# Altium project picr22-team-GibiBot-mainboard.PrjPcb
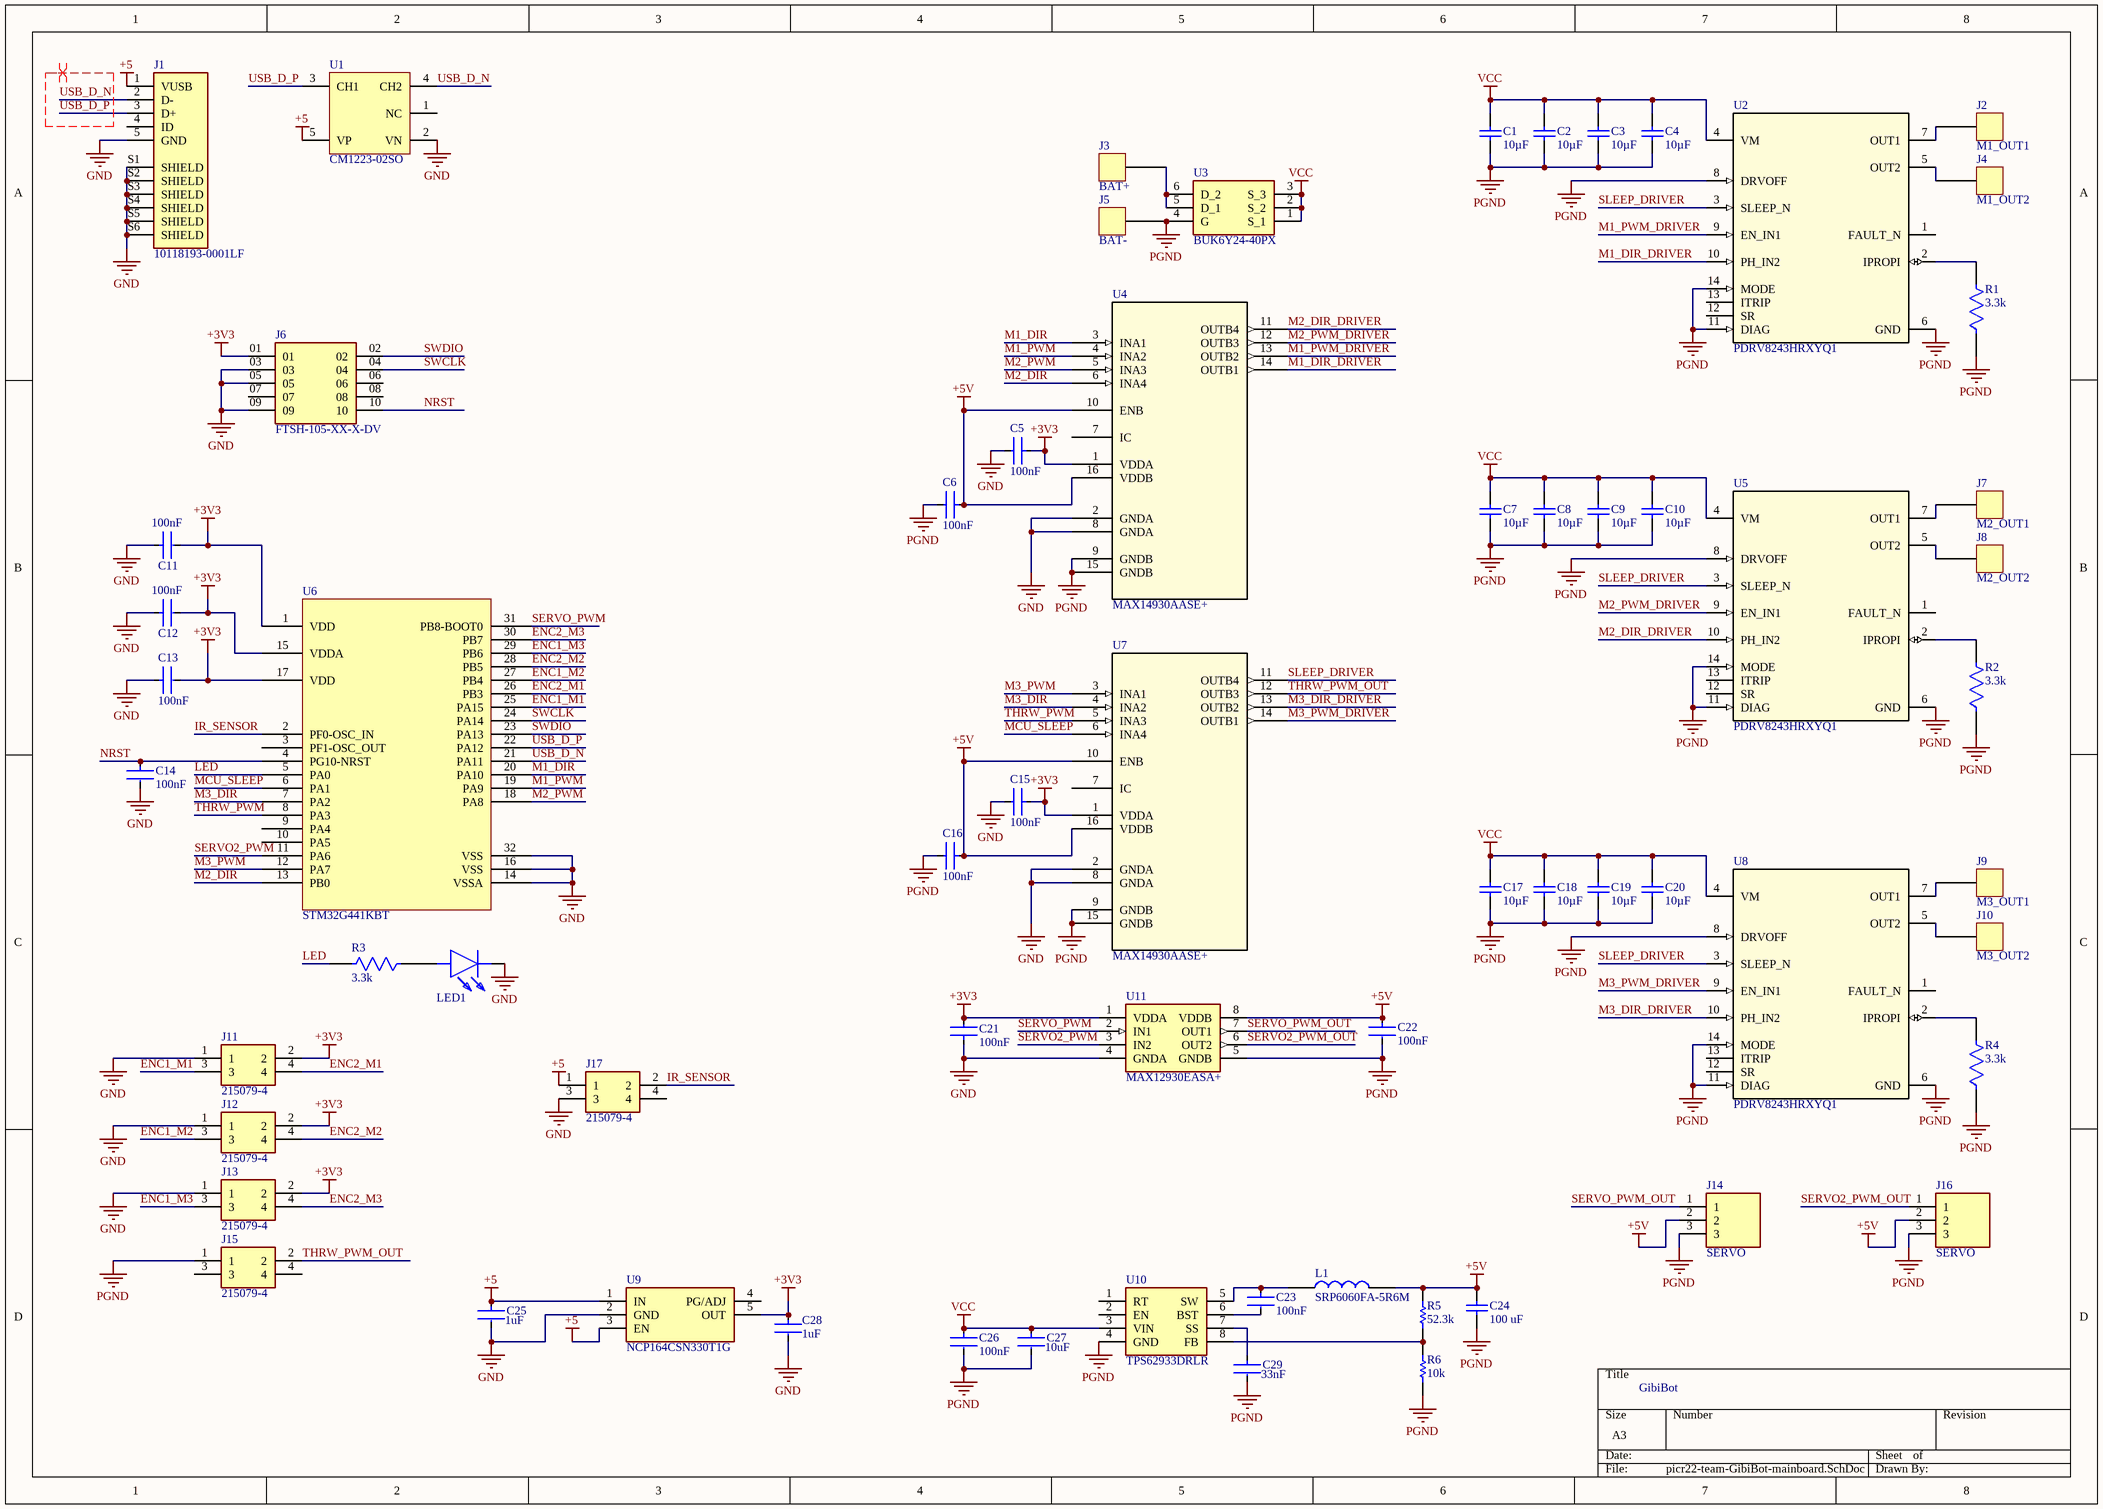
[diagram p0: picr22-team-GibiBot-mainboard.SchDoc]
1 sheet, 65 parts. Net scope: global (net labels, ports and power ports of the same name join across sheets).
Board file: picr22-team-GibiBot-mainboard.PcbDoc

## Sheet picr22-team-GibiBot-mainboard.SchDoc
size A3; SheetNumber: 1; SheetTotal: 1

### Parts
C1  Capacitance: 10µF  [MURA-0805_H_1.35_M]  (hidden comment: GRM21BR61A106KE19L)
C2  Capacitance: 10µF  [MURA-0805_H_1.35_M]  (hidden comment: GRM21BR61A106KE19L)
C3  Capacitance: 10µF  [MURA-0805_H_1.35_M]  (hidden comment: GRM21BR61A106KE19L)
C4  Capacitance: 10µF  [MURA-0805_H_1.35_M]  (hidden comment: GRM21BR61A106KE19L)
C5  Capacitance: 100nF  [FP-CGA3E-0_3-0_1-IPC_A]  (hidden comment: CGA3E2X7R1H104K080AA)
C6  Capacitance: 100nF  [FP-CGA3E-0_3-0_1-IPC_A]  (hidden comment: CGA3E2X7R1H104K080AA)
C7  Capacitance: 10µF  [MURA-0805_H_1.35_M]  (hidden comment: GRM21BR61A106KE19L)
C8  Capacitance: 10µF  [MURA-0805_H_1.35_M]  (hidden comment: GRM21BR61A106KE19L)
C9  Capacitance: 10µF  [MURA-0805_H_1.35_M]  (hidden comment: GRM21BR61A106KE19L)
C10  Capacitance: 10µF  [MURA-0805_H_1.35_M]  (hidden comment: GRM21BR61A106KE19L)
C11  Capacitance: 100nF  [FP-CGA3E-0_3-0_1-IPC_A]  (hidden comment: CGA3E2X7R1H104K080AA)
C12  Capacitance: 100nF  [FP-CGA3E-0_3-0_1-IPC_A]  (hidden comment: CGA3E2X7R1H104K080AA)
C13  Capacitance: 100nF  [FP-CGA3E-0_3-0_1-IPC_A]  (hidden comment: CGA3E2X7R1H104K080AA)
C14  Capacitance: 100nF  [FP-CGA3E-0_3-0_1-IPC_A]  (hidden comment: CGA3E2X7R1H104K080AA)
C15  Capacitance: 100nF  [FP-CGA3E-0_3-0_1-IPC_A]  (hidden comment: CGA3E2X7R1H104K080AA)
C16  Capacitance: 100nF  [FP-CGA3E-0_3-0_1-IPC_A]  (hidden comment: CGA3E2X7R1H104K080AA)
C17  Capacitance: 10µF  [MURA-0805_H_1.35_M]  (hidden comment: GRM21BR61A106KE19L)
C18  Capacitance: 10µF  [MURA-0805_H_1.35_M]  (hidden comment: GRM21BR61A106KE19L)
C19  Capacitance: 10µF  [MURA-0805_H_1.35_M]  (hidden comment: GRM21BR61A106KE19L)
C20  Capacitance: 10µF  [MURA-0805_H_1.35_M]  (hidden comment: GRM21BR61A106KE19L)
C21  Capacitance: 100nF  [FP-CGA3E-0_3-0_1-IPC_A]  (hidden comment: CGA3E2X7R1H104K080AA)
C22  Capacitance: 100nF  [FP-CGA3E-0_3-0_1-IPC_A]  (hidden comment: CGA3E2X7R1H104K080AA)
C23  Capacitance: 100nF  [FP-CGA3E-0_3-0_1-IPC_A]  (hidden comment: CGA3E2X7R1H104K080AA)
C24  Capacitance: 100 uF  [CAPC3216X190X55ML30T25]  (hidden comment: GRM31CR60J107ME39L)
C25  Capacitance: 1uF  [FP-C1608-080-0_1-MFG]  (hidden comment: C1608X5R1C105K080AA)
C26  Capacitance: 100nF  [FP-CGA3E-0_3-0_1-IPC_A]  (hidden comment: CGA3E2X7R1H104K080AA)
C27  Capacitance: 10uF  [FP-C3216-160-0_2-IPC_C]  (hidden comment: C3216X7R1V106M160AC)
C28  Capacitance: 1uF  [FP-C1608-080-0_1-MFG]  (hidden comment: C1608X5R1C105K080AA)
C29  Capacitance: 33nF  [FP-CL10-IPC_B]  (hidden comment: CL10B333KB8NNNC)
J1  10118193-0001LF  [FCI_10118193-0001LF]
J2  M1_OUT1  [Power pad]
J3  BAT+  [Power pad]
J4  M1_OUT2  [Power pad]
J5  BAT-  [Power pad]
J6  FTSH-105-XX-X-DV  [SAMTEC_FTSH-105-XX-X-DV]
J7  M2_OUT1  [Power pad]
J8  M2_OUT2  [Power pad]
J9  M3_OUT1  [Power pad]
J10  M3_OUT2  [Power pad]
J11  215079-4  [TE_215079-4]
J12  215079-4  [TE_215079-4]
J13  215079-4  [TE_215079-4]
J14  SERVO  [SERVO]
J15  215079-4  [TE_215079-4]
J16  SERVO  [SERVO]
J17  215079-4  [TE_215079-4]
L1  SRP6060FA-5R6M  [SRP6060FA5R6M]
LED1  150060SS75000  [LEDC1608X80N]  (value not drawn)
R1  Resistance: 3.3k  [FP-CRCW0603-e3-MFG]  (hidden comment: CRCW06031M00FKEA)
R2  Resistance: 3.3k  [FP-CRCW0603-e3-MFG]  (hidden comment: CRCW06031M00FKEA)
R3  Resistance: 3.3k  [FP-CRCW0603-e3-MFG]  (hidden comment: CRCW06031M00FKEA)
R4  Resistance: 3.3k  [FP-CRCW0603-e3-MFG]  (hidden comment: CRCW06031M00FKEA)
R5  Resistance: 52.3k  [RESC1608X55X25LL10T15]  (hidden comment: RC0603FR-0752K3L)
R6  Resistance: 10k  [RESC1609X50X30NL8T20]  (hidden comment: CRCW060310K0FKEA)
U1  CM1223-02SO  [ONSC-SOT23-5-527AH-01_L]
U2  PDRV8243HRXYQ1  [RXY0014A-MFG]
U3  BUK6Y24-40PX  [BUK6Y2440PX]
U4  MAX14930AASE+  [21-0041_S16+1_MXM]
U5  PDRV8243HRXYQ1  [RXY0014A-MFG]
U6  STM32G441KBT  [STM32G441KB]
U7  MAX14930AASE+  [21-0041_S16+1_MXM]
U8  PDRV8243HRXYQ1  [RXY0014A-MFG]
U9  NCP164CSN330T1G  [SOT95P275X110-5N]
U10  TPS62933DRLR  [SOTFL50P160X60-8N]
U11  MAX12930EASA+  [SOIC127P600X175-8N]

### Nets
+3V3: C5.1 C11.2 C12.2 C13.2 C15.1 C21.2 C28.2 J6.01 J11.2 J12.2 J13.2 U4.1(VDDA) U6.1(VDD) U6.15(VDDA) U6.17(VDD) U7.1(VDDA) U9.5(OUT) U11.1(VDDA)
+5: C25.2 J1.1(VUSB) J17.1 U1.5(VP) U9.1(IN) U9.3(EN)
+5V: C6.1 C16.1 C22.1 C24.2 J14.2 J16.2 L1.2 R5.2 U4.10(ENB) U4.16(VDDB) U7.10(ENB) U7.16(VDDB) U11.8(VDDB)
GND: C5.2 C11.1 C12.1 C13.1 C14.2 C15.2 C21.1 C25.1 C28.1 J1.5(GND) J1.S1(SHIELD) J1.S2(SHIELD) J1.S3(SHIELD) J1.S4(SHIELD) J1.S5(SHIELD) J1.S6(SHIELD) J6.03 J6.05 J6.09 J11.1 J12.1 J13.1 J17.3 LED1.1(K) U1.2(VN) U4.2(GNDA) U4.8(GNDA) U6.14(VSSA) U6.16(VSS) U6.32(VSS) U7.2(GNDA) U7.8(GNDA) U9.2(GND) U11.4(GNDA)
PGND: C1.1 C2.1 C3.1 C4.1 C6.2 C7.1 C8.1 C9.1 C10.1 C16.2 C17.1 C18.1 C19.1 C20.1 C22.2 C24.1 C26.2 C27.2 C29.2 J5.2(PAD) J14.3 J15.1 J16.3 R1.1 R2.1 R4.1 R6.1 U2.6(GND) U2.8(DRVOFF) U2.11(DIAG) U2.14(MODE) U3.4(G) U4.9(GNDB) U4.15(GNDB) U5.6(GND) U5.8(DRVOFF) U5.11(DIAG) U5.14(MODE) U7.9(GNDB) U7.15(GNDB) U8.6(GND) U8.8(DRVOFF) U8.11(DIAG) U8.14(MODE) U10.4(GND) U11.5(GNDB)
VCC: C1.2 C2.2 C3.2 C4.2 C7.2 C8.2 C9.2 C10.2 C17.2 C18.2 C19.2 C20.2 C26.1 C27.1 U2.4(VM) U3.1(S_1) U3.2(S_2) U3.3(S_3) U5.4(VM) U8.4(VM) U10.3(VIN)
ENC1_M1: J11.3 U6.25(PA15)
ENC1_M2: J12.3 U6.27(PB4)
ENC1_M3: J13.3 U6.29(PB6)
ENC2_M1: J11.4 U6.26(PB3)
ENC2_M2: J12.4 U6.28(PB5)
ENC2_M3: J13.4 U6.30(PB7)
IR_SENSOR: J17.2 U6.2(PF0-OSC_IN)
LED: R3.2 U6.5(PA0)
M1_DIR: U4.3(INA1) U6.20(PA10)
M1_DIR_DRIVER: U2.10(PH_IN2) U4.14(OUTB1)
M1_PWM: U4.4(INA2) U6.19(PA9)
M1_PWM_DRIVER: U2.9(EN_IN1) U4.13(OUTB2)
M2_DIR: U4.6(INA4) U6.13(PB0)
M2_DIR_DRIVER: U4.11(OUTB4) U5.10(PH_IN2)
M2_PWM: U4.5(INA3) U6.18(PA8)
M2_PWM_DRIVER: U4.12(OUTB3) U5.9(EN_IN1)
M3_DIR: U6.7(PA2) U7.4(INA2)
M3_DIR_DRIVER: U7.13(OUTB2) U8.10(PH_IN2)
M3_PWM: U6.12(PA7) U7.3(INA1)
M3_PWM_DRIVER: U7.14(OUTB1) U8.9(EN_IN1)
MCU_SLEEP: U6.6(PA1) U7.6(INA4)
NRST: C14.1 J6.10 U6.4(PG10-NRST)
SERVO2_PWM: U6.11(PA6) U11.3(IN2)
SERVO2_PWM_OUT: J16.1 U11.6(OUT2)
SERVO_PWM: U6.31(PB8-BOOT0) U11.2(IN1)
SERVO_PWM_OUT: J14.1 U11.7(OUT1)
SLEEP_DRIVER: U2.3(SLEEP_N) U5.3(SLEEP_N) U7.11(OUTB4) U8.3(SLEEP_N)
SWCLK: J6.04 U6.24(PA14)
SWDIO: J6.02 U6.23(PA13)
THRW_PWM: U6.8(PA3) U7.5(INA3)
THRW_PWM_OUT: J15.2 U7.12(OUTB3)
USB_D_N: J1.2(D-) U1.4(CH2) U6.21(PA11)
USB_D_P: J1.3(D+) U1.3(CH1) U6.22(PA12)
NetC23_1: C23.1 L1.1 U10.5(SW)
NetC23_2: C23.2 U10.6(BST)
NetC29_1: C29.1 U10.7(SS)
NetJ2_2: J2.2(PAD) U2.7(OUT1)
NetJ3_2: J3.2(PAD) U3.5(D_1) U3.6(D_2)
NetJ4_2: J4.2(PAD) U2.5(OUT2)
NetJ7_2: J7.2(PAD) U5.7(OUT1)
NetJ8_2: J8.2(PAD) U5.5(OUT2)
NetJ9_2: J9.2(PAD) U8.7(OUT1)
NetJ10_2: J10.2(PAD) U8.5(OUT2)
NetLED1_2: LED1.2(A) R3.1
NetR1_2: R1.2 U2.2(IPROPI)
NetR2_2: R2.2 U5.2(IPROPI)
NetR4_2: R4.2 U8.2(IPROPI)
NetR5_1: R5.1 R6.2 U10.8(FB)

Not connected (* = marked no-connect by the designer): J1 4(ID); J6 06 07 08; J15 3 4; J17 4; U1 1(NC); U2 1(FAULT_N) 12(SR) 13(ITRIP); U4 7(IC); U5 1(FAULT_N) 12(SR) 13(ITRIP); U6 3(PF1-OSC_OUT) 9(PA4) 10(PA5); U7 7(IC); U8 1(FAULT_N) 12(SR) 13(ITRIP); U9 4(PG/ADJ); U10 1(RT) 2(EN)

### Layout directives
differential pair; differential pair class USB: USB_D_N, USB_D_P

### Notes on the sheet
- GibiBot

### Library data of the parts
C1-C4 C7-C10 C17-C20 = CMP-2000-05254-1: CAP, Ceramic, 10 uF, 10%, 10 V, 0805, RoHS, Tape and Reel; Manufacturer: Murata; Voltage - Rated: 10V; Product Training Modules: High-CapMultilayerCeramicCapacitors; Catalog Drawings: GRMSeries_0805_1.25; Temperature Coefficient: X5R; Online Catalog: GRMSeries; Featured Product: GA3SafetyRecognizedCapsandHi-CapMLCC; Other Names: 490-1709-6; Applications: GeneralPurpose; Category: Capacitors; Datasheet Version: Aug-14; Datasheet URL: https://datasheet.ciiva.com/3777/210grm21br61a106ke1923-3777175.pdf; Ratings: -; Height - Seated (Max): -; Lead Spacing: -; Operating Temperature: -55degC~85degC; Features: -; Package Description: 2-Pin Surface Mount Device (0805), Body 2.1 x 1.35 mm; Standard Package: 1; Mounting Type: SurfaceMount,MLCC; Package Reference: 805; Tolerance: ±10%; Manufacturer URL: http://www.murata.com/; Size / Dimension: 0.079"Lx0.049"W(2.00mmx1.25mm); Packaging: Digi-Reel; Thickness (Max): 0.053"(1.35mm); Package / Case: 0805(2012Metric); Family: CeramicCapacitors; Series: GRM; Lead Style: -
C5 C6 C11-C16 C21-C23 C26 = CMP-2000-07546-2: Cap Ceramic 100nF 50V X7R 10% Pad SMD 0603 +125°C Automotive T/R; Weight: 7.1E-05oz; Composition: Ceramic; Max Operating Temperature: 125°C; Termination: SMD/SMT; Dielectric: X7R; Length: 1.6mm; Package Quantity: 1; REACH SVHC: No SVHC; Lead Free: Lead Free; Case Code (Metric): 1608; Min Operating Temperature: -55°C; Packaging: Tape and Reel; Tolerance: 10%; Voltage Rating: 50V; Case Code (Imperial): 0603; Case/Package: 0603; Voltage Rating (DC): 50V; Depth: 0.8mm; Radiation Hardening: No; Ratings: AEC-Q200; Mount: Surface Mount; Voltage: 50V; Thickness: 0.035inch; Width: 0.8mm; Height: 0.8mm
C24 = CMP-1662-00011-2: Chip Capacitor, 100 uF, +/- 20%, 6.3 V, -55 to 85 degC, 1206 (3216 Metric), RoHS, Tape and Reel; Case\/Package: 1206; Voltage Rating (DC): 6.3 V; Type (Capacitors): X5R; REACH SVHC: No SVHC; Height: 1.6 mm; Tolerance: 20%; Packaging: Tape and Reel; Mount: Surface Mount; PackageDescription: 2-Pin Surface Mount Device, Body 3.2 x 1.6 mm; ComponentLink1URL: http://www.murata.com/; Pins: 2; ComponentLink2Description: Datasheet; PackageReference: 1206; Width: 1.6 mm; Package Quantity: 2000; Min Operating Temperature: -55 degC; Case Code (Imperial): 1206; Max Operating Temperature: 85 degC; DatasheetVersion: 09/2016; Mounting Technology: Surface Mount; Voltage Rating: 6.3 V; ComponentLink1Description: Manufacturer URL; Radiation Hardening: No; Case Code (Metric): 3216; PartNumber: GRM31CR60J107ME39L; Length: 3.2 mm; ComponentLink2URL: http://psearch.en.murata.com/capacitor/product/GRM31CR60J107ME39%23.pdf; RoHSCompliant: true
C25 C28 = CMP-08246-006723-1: Multilayer Ceramic Capacitors 1μF ±10% 16V X5R SMD 0603; Package Quantity: 1; Contact Plating: Tin; Min Operating Temperature: -55°C; Voltage Rating (DC): 16V; RoHS Compliant: Yes; Construction: Flat; Height: 0.8mm; Resistor Type: Ceramic; Depth: 0.8mm; Case/Package: 0603; Mount: Surface Mount; Packaging: Tape and Reel; Dielectric: X5R; Number of Pins: 2; Radiation Hardening: No; Case Code (Metric): 1608; Dielectric Material: Ceramic; Voltage Rating: 16V; REACH SVHC: No SVHC; Series: C; Case Code (Imperial): 0603; Voltage: 16V; Width: 0.031inch; Tolerance: 10%; Max Operating Temperature: 85°C; Weight: 7.1E-05oz; Thickness: 0.037inch; Termination: SMD/SMT; Length: 1.6mm; Lead Free: Lead Free
C27 = CMP-2000-06048-2: Multilayer Ceramic Capacitors 10uF ±20% 35V X7R SMD 1206; RoHS Compliant: Yes; Voltage Rating (DC): 35V; Termination: SMD/SMT; Thickness: 0.071inch; Max Operating Temperature: 125°C; Length: 3.2mm; Width: 0.063inch; Tolerance: 20%; Case Code (Metric): 3216; REACH SVHC: No SVHC; Case/Package: 1206; Dielectric: X7R; Series: C; Min Operating Temperature: -55°C; Resistor Type: Ceramic; Weight: 0.000571oz; Voltage Rating: 35V; Mount: Surface Mount; Package Quantity: 2000; Case Code (Imperial): 1206; Depth: 1.6mm; Packaging: Tape and Reel; Dielectric Material: Ceramic; Lead Free: Lead Free; Height: 1.6mm; Construction: Flat
C29 = CMP-13271-001282-1: Cap Ceramic 33nF 50V X7R ±10% Pad SMD 0603 +125°C T/R; Width: 0.031inch; Thickness: 0.035inch; Dielectric: X7R; Depth: 0.8mm; Radiation Hardening: No; Package Quantity: 1; Max Operating Temperature: 125°C; Material: Ceramic; Voltage: 50V; Mount: Surface Mount; Min Operating Temperature: -55°C; Case Code (Metric): 1608; Packaging: Tape and Reel; Contact Plating: Tin; Height: 0.8mm; Length: 1.6mm; Voltage Rating: 50V; Case Code (Imperial): 0603; Tolerance: 10%; Case/Package: 0603
J1 = 10118193-0001LF: USB - micro B USB 2.0 Receptacle Connector 5 Position Surface Mount, Right Angle; Through Hole; MF: Amphenol ICC; Availability: Unavailable; SnapEDA_Link: https://www.snapeda.com/parts/10118193-0001LF/Amphenol%20FCI/view-part/2758989/?ref=snap; MP: 10118193-0001LF; Price: None; Value: *; Package: None
J2-J5 J7-J10 = Power pad
J6 = FTSH-105-XX-X-DV: Connector Header Surface Mount 10 position 0.050" (1.27mm); Availability: Unavailable; Package: None; MP: FTSH-105-XX-X-DV; Price: None; Value: *
J11-J13 J15 J17 = 215079-4: 4 Position Receptacle Connector Through Hole; MF: TE Connectivity; Price: None; Availability: Unavailable; SnapEDA_Link: https://www.snapeda.com/parts/215079-4/TE%20Connectivity%20AMP%20Connectors/view-part/2366486/?ref=snap; EU_RoHS_Compliance: Compliant; Value: *; MP: 215079-4; TE_purchase_URL: https://www.te.com/usa-en/product-215079-4.html?te_bu=Cor&te_type=disp&te_campaign=seda_glo_cor-seda-global-disp-prtnr-fy19-seda-model-bom-cta_sma-317_1&elqCampaignId=32493; Package: SMD-6 Omron Electronics
J14 J16 = SERVO: Connector; Manufacturer_Name: Amphenol; Datasheet Link: https://cdn.amphenol-cs.com/media/wysiwyg/files/drawing/78208.pdf; Height: 5.54mm; Mouser Part Number: 649-78208-103; Mouser Price/Stock: https://www.mouser.co.uk/ProductDetail/Amphenol-FCI/78208-103?qs=aFaVeqgBj1H8lO9kIoPCww%3D%3D; Arrow Part Number: 78208-103; Arrow Price/Stock: https://www.arrow.com/en/products/78208-103/amphenol-fci
L1 = SRP6060FA-5R6M: BOURNS - SRP6060FA-5R6M - Power Inductor (SMD), 5.6 H, 10 A, Shielded, 10 A, SRP6060FA Series, 6.6mm x 6.4mm x 5.8mm; Geometry.Height: 6mm; On Line Components Part Number: *; On Line Components Price/Stock: *; Manufacturer_Name: Bourns; Manufacturer_Part_Number: SRP6060FA-5R6M; Datasheet Link: https://www.bourns.com/docs/Product-Datasheets/SRP6060FA.pdf
LED1 = 150060SS75000: LED; Manufacturer_Name: Wurth Elektronik; Height: 0.8mm; Manufacturer_Part_Number: 150060SS75000; Mouser Part Number: 710-150060SS75000; Mouser Price/Stock: https://www.mouser.co.uk/ProductDetail/Wurth-Elektronik/150060SS75000?qs=LlUlMxKIyB0oQaxwspeTEA%3D%3D
R1-R4 = CMP-2000-03013-2: RES Thick Film, 1MΩ, 1%, 0.1W, 100ppm/°C, 0603; Max Power Dissipation: 100mW; Voltage Rating (DC): 75V; Depth: 0.85mm; Max Operating Temperature: 155°C; Length: 1.55mm; Power Rating: 100mW; Military Standard: Not; Features: Automotive AEC-Q200; Min Operating Temperature: -55°C; Number of Pins: 2; Mount: Surface Mount; Package Quantity: 10; Packaging: Tape and Reel; Height: 0.45mm; Radiation Hardening: No; Case Code (Metric): 1608; Temperature Coefficient: 100ppm/°C; Width: 0.85mm; Composition: Thick Film; Termination: SMD/SMT; Tolerance: 1%; Number of Terminations: 2; Lead Free: Lead Free; Contact Plating: Tin; Case/Package: 0603; Weight: 7.1E-05oz; Voltage Rating: 75V; Case Code (Imperial): 0603
R5 = CMP-1012-00705-2: Manufacturer: Yageo; Part Number: RC0603FR-0752K3L
R6 = CMP-1666-00005-4: Chip Resistor, 10 KOhm, +/- 1%, 100 mW, -55 to 155 degC, 0603 (1608 Metric), RoHS, Tape and Reel; Manufacturer: Vishay Semiconductor; Voltage Rating: 75 V; Max Operating Temperature: 155 degC; PackageDescription: 2-Pin Surface Mount Device, Body 1.575 x 0.85 mm; ComponentLink1Description: Manufacturer URL; RoHSCompliant: true; PackageReference: 0603; REACH SVHC: Unknown; Length: 1.55 mm; DatasheetVersion: 06/2012; Packaging: Tape and Reel; Min Operating Temperature: -55 degC; Mounting Technology: Surface Mount; ComponentLink2URL: https://datasheet.ciiva.com/11809/0900766b80d98afc-11809037.pdf; Height: 0.45 mm; ComponentLink2Description: Datasheet; Package Quantity: 5000; ComponentLink1URL: http://www.vishay.com/
U1 = CMP-1063-00173-1: Industry First Low Capacitance ESD Protection Arrays with Backdrive Protection, 5-Pin SOT-23, Pb-Free, Tape and Reel; Manufacturer: On Semiconductor; Direction: Unidirectional; PPK Max (W): 0.225; C Max (pF): 1.5; Number of Lines: 2; ComponentLink1Description: Manufacturer URL; PackageReference: SOT23-5-527AH-01; ComponentLink3URL: http://www.onsemi.com/pub_link/Collateral/527AH.PDF; ComponentLink1URL: http://www.onsemi.com/; PackageDescription: 5-Pin Small Outline Transistor, Body 2.9 x 1.6 mm, Pitch 0.95 mm; ComponentLink2URL: http://www.onsemi.com/pub_link/Collateral/CM1223-D.PDF; PackageVersion: Rev. O, 12/2008; ComponentLink3Description: Package Specification; PartNumber: CM1223-02SO; DatasheetVersion: Rev. 6; RoHS: Pb-Free; Code_JEDEC: MO-178; ComponentLink2Description: Datasheet; Packing: Tape and Reel; Mounting Technology: Surface Mount
U2 U5 U8 = PDRV8243HRXYQ1: No Description Available; Mfr_Name: Texas Instruments; Type: DEV; RefDes: RefDes; Copyright: Copyright (C) 2022 Ultra Librarian. All rights reserved.; Manufacturer_Part_Number: PDRV8243HRXYQ1
U3 = BUK6Y24-40PX: MOSFET (P-Channel); Manufacturer_Name: Nexperia; Datasheet Link: https://assets.nexperia.com/documents/data-sheet/BUK6Y24-40P.pdf; Height: 1.2mm; Manufacturer_Part_Number: BUK6Y24-40PX; Mouser Part Number: 771-BUK6Y24-40PX; Mouser Price/Stock: https://www.mouser.co.uk/ProductDetail/Nexperia/BUK6Y24-40PX?qs=vmHwEFxEFR8tyd2WwTEwBg%3D%3D; Arrow Part Number: BUK6Y24-40PX; Arrow Price/Stock: https://www.arrow.com/en/products/buk6y24-40px/nexperia?region=nac
U4 U7 = MAX14930AASE+: No Description Available; Mfr_Name: Maxim Integrated Products; Copyright: Copyright (C) 2022 Ultra Librarian. All rights reserved.; Manufacturer_Part_Number: MAX14930AASE+; RefDes: RefDes; Type: DEV
U6 = STM32G441xB
U9 = NCP164CSN330T1G: Integrated Circuit; Manufacturer_Name: onsemi; Datasheet Link: https://componentsearchengine.com/Datasheets/2/NCP164CSN330T1G.pdf; Height: 1.1mm; Manufacturer_Part_Number: NCP164CSN330T1G; Mouser Part Number: 863-NCP164CSN330T1G; Mouser Price/Stock: https://www.mouser.co.uk/ProductDetail/onsemi/NCP164CSN330T1G?qs=xZ%2FP%252Ba9zWqbi%2FAyy5UtoRw%3D%3D; Arrow Part Number: NCP164CSN330T1G; Arrow Price/Stock: https://www.arrow.com/en/products/ncp164csn330t1g/on-semiconductor?region=nac
U10 = TPS62933DRLR: Integrated Circuit; Manufacturer_Name: Texas Instruments; Datasheet Link: https://www.ti.com/lit/ds/symlink/tps62933.pdf?ts=1626073394234; Height: 0.6mm; Manufacturer_Part_Number: TPS62933DRLR; Mouser Part Number: 595-TPS62933DRLR; Mouser Price/Stock: https://www.mouser.co.uk/ProductDetail/Texas-Instruments/TPS62933DRLR?qs=Rp5uXu7WBW9fv47wfQVntQ%3D%3D; Arrow Part Number: TPS62933DRLR; Arrow Price/Stock: https://www.arrow.com/en/products/tps62933drlr/texas-instruments?region=nac
U11 = MAX12930EASA+: Integrated Circuit; Manufacturer_Name: Maxim Integrated; Datasheet Link: https://ms.componentsearchengine.com/Datasheets/1/MAX12930EASA+.pdf; Height: 1.75mm; Manufacturer_Part_Number: MAX12930EASA+; Mouser Part Number: 700-MAX12930EASA+; Mouser Price/Stock: https://www.mouser.com/Search/Refine.aspx?Keyword=700-MAX12930EASA%2B